# Altium project ruler.PrjPcb
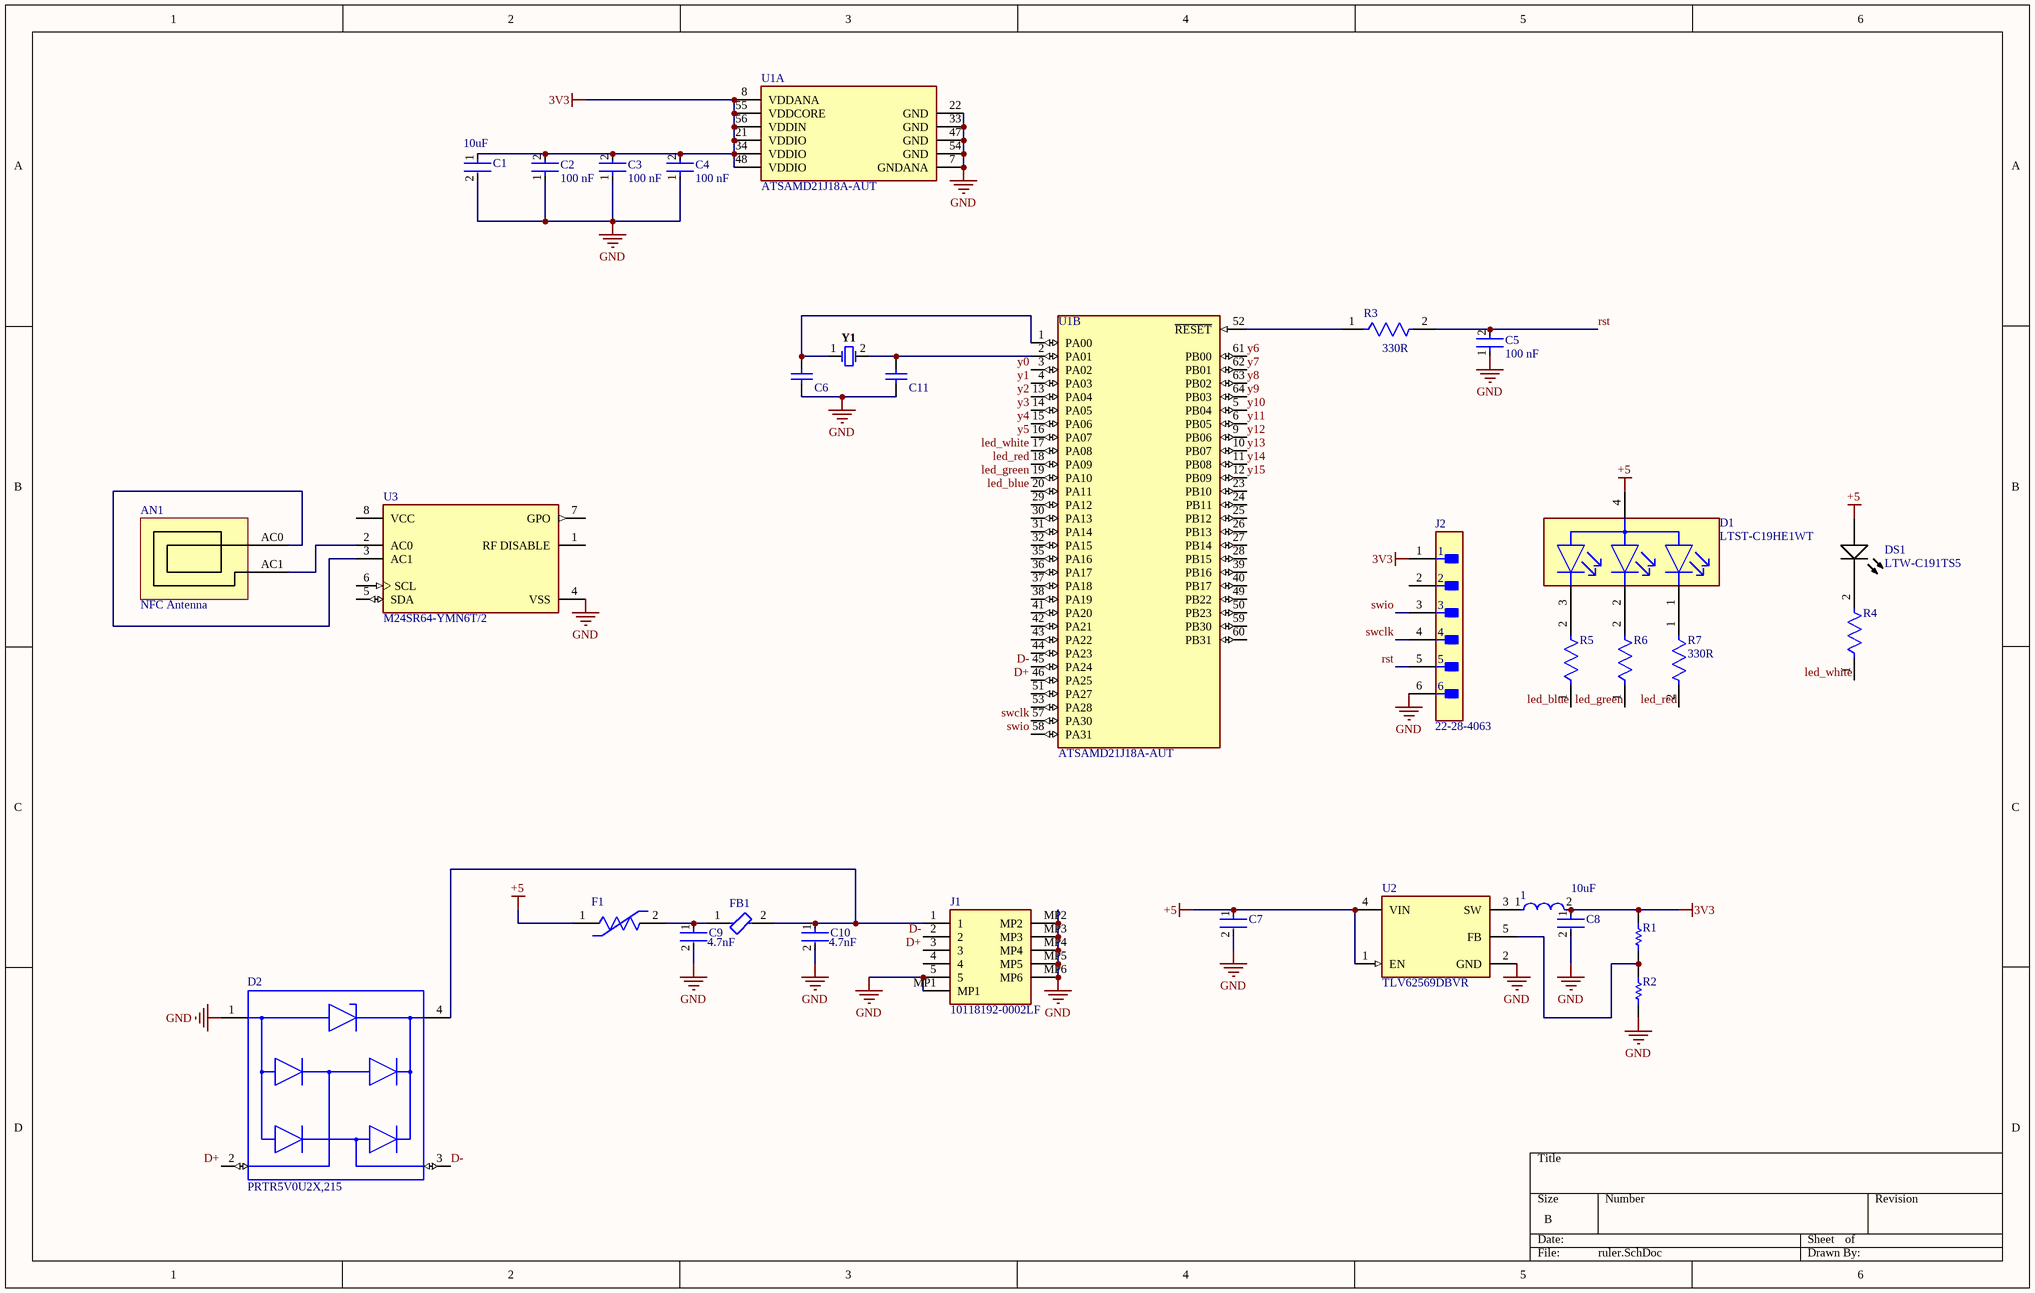
[diagram p0: ruler.SchDoc]
1 sheet, 31 parts. Net scope: global (net labels, ports and power ports of the same name join across sheets).
Board file: ruler.PcbDoc

## Sheet ruler.SchDoc
size B; SheetNumber: 1; SheetTotal: 1

### Parts
1  LQM2HPN2R2MG0L  [FP-LQM2HPN_G0-IPC_C]  (value not drawn)
AN1  NFC Antenna  [NFC_Antenna]  (no BOM)
C1  Capacitance: 10uF  [FP-CL10-IPC_B]  (hidden comment: CL10A106MP8NNNC)
C2  Capacitance: 100 nF  [FP-CC0603-DA-MFG]  (hidden comment: CC0603KRX7R9BB104)
C3  Capacitance: 100 nF  [FP-CC0603-DA-MFG]  (hidden comment: CC0603KRX7R9BB104)
C4  Capacitance: 100 nF  [FP-CC0603-DA-MFG]  (hidden comment: CC0603KRX7R9BB104)
C5  Capacitance: 100 nF  [FP-CC0603-DA-MFG]  (hidden comment: CC0603KRX7R9BB104)
C6  GRM1555C1E6R8CA01D  [CAPC1005X55X25NL05T10]  (value not drawn)
C7  CL10A475KP8NNNC  [FP-CL10-IPC_C]  (value not drawn)
C8  Capacitance: 10uF  [FP-CL10-IPC_B]  (hidden comment: CL10A106MP8NNNC)
C9  Capacitance: 4.7nF  [FP-GRM188-0_1-e0_2_0_5-MFG]  (hidden comment: GRM1885C1H472JA01D)
C10  Capacitance: 4.7nF  [FP-GRM188-0_1-e0_2_0_5-MFG]  (hidden comment: GRM1885C1H472JA01D)
C11  GRM1555C1E6R8CA01D  [CAPC1005X55X25NL05T10]  (value not drawn)
D1  LTST-C19HE1WT  [FP-LTST-C19HE1WT-MFG]
D2  PRTR5V0U2X,215  [FP-SOT143B-MFG]
DS1  LTW-C191TS5  [LTST-LTW-C191TS5_V]
F1  MF-MSMF050-2  [FP-MF-MSMF050-2-MFG]  (value not drawn)
FB1  BLM18PG471SN1D  [FP-BLM18-0_15-t0_8-MFG]  (value not drawn)
J1  10118192-0002LF  [101181920002LF]
J2  22-28-4063  [FP-22-28-4063-MFG]
R1  ERJ3EKF1913V  [RESC1608X55X30LL15T15]  (value not drawn)
R2  CRCW060342K2FKEA  [RESC1609X50X30ML10T20]  (value not drawn)
R3  Resistance: 330R  [FP-ERJPA3-MFG]  (hidden comment: ERJ-PA3J331V)
R4  ERJ-3EKF2000V  [FP-ERJ3EK-IPC_C]  (value not drawn)
R5  ERJ-3EKF2000V  [FP-ERJ3EK-IPC_C]  (value not drawn)
R6  ERJ-3EKF2000V  [FP-ERJ3EK-IPC_C]  (value not drawn)
R7  Resistance: 330R  [FP-ERJPA3-MFG]  (hidden comment: ERJ-PA3J331V)
U1  ATSAMD21J18A-AUT  [FP-MF-IPC_C]  (parts A,B of 2)
U2  TLV62569DBVR  [FP-DBV0005A-MFG]
U3  M24SR64-YMN6T/2  [FP-SO-A-MFG]
Y1  CM315D32768DZFT  [CMHT-CM315D-2_V]  (value not drawn)

### Nets
3V3: 1.2 C1.1 C2.2 C3.2 C4.2 C8.1 J2.1 R1.2 U1.8(VDDANA) U1.21(VDDIO) U1.34(VDDIO) U1.48(VDDIO) U1.55(VDDCORE) U1.56(VDDIN)
+5: C7.1 D1.4(A) DS1.1(A) F1.1 U2.1(EN) U2.4(VIN)
GND: C1.2 C2.1 C3.1 C4.1 C5.1 C6.1 C7.2 C8.2 C9.2 C10.2 C11.1 D2.1(GND) J1.5 J1.MP1 J1.MP2 J1.MP3 J1.MP4 J1.MP5 J1.MP6 J2.6 R2.1 U1.7(GNDANA) U1.22(GND) U1.33(GND) U1.47(GND) U1.54(GND) U2.2(GND) U3.4(VSS)
D+: D2.2(I/O_1) J1.3 U1.46(PA25)
D-: D2.3(I/O_2) J1.2 U1.45(PA24)
led_blue: R5.1 U1.20(PA11)
led_green: R6.1 U1.19(PA10)
led_red: R7.2 U1.18(PA09)
led_white: R4.1 U1.17(PA08)
rst: C5.2 J2.5 R3.2
swclk: J2.4 U1.57(PA30)
swio: J2.3 U1.58(PA31)
y0: U1.3(PA02)
y1: U1.4(PA03)
y2: U1.13(PA04)
y3: U1.14(PA05)
y4: U1.15(PA06)
y5: U1.16(PA07)
y6: U1.61(PB00)
y7: U1.62(PB01)
y8: U1.63(PB02)
y9: U1.64(PB03)
y10: U1.5(PB04)
y11: U1.6(PB05)
y12: U1.9(PB06)
y13: U1.10(PB07)
y14: U1.11(PB08)
y15: U1.12(PB09)
Net1_1: 1.1 U2.3(SW)
NetAN1_AC0: AN1.AC0 U3.3(AC1)
NetAN1_AC1: AN1.AC1 U3.2(AC0)
NetC6_2: C6.2 U1.1(PA00) Y1.1
NetC9_1: C9.1 F1.2 FB1.1
NetC10_1: C10.1 D2.4(VCC) FB1.2 J1.1
NetC11_2: C11.2 U1.2(PA01) Y1.2
NetD1_1: D1.1(RED_C) R7.1
NetD1_2: D1.2(GREEN_C) R6.2
NetD1_3: D1.3(BLUE_C) R5.2
NetDS1_2: DS1.2(K) R4.2
NetR1_1: R1.1 R2.2 U2.5(FB)
NetR3_1: R3.1 U1.52(~{RESET})

Not connected (* = marked no-connect by the designer): J1 4; J2 2; U1 23(PB10) 24(PB11) 25(PB12) 26(PB13) 27(PB14) 28(PB15) 29(PA12) 30(PA13) 31(PA14) 32(PA15) 35(PA16) 36(PA17) 37(PA18) 38(PA19) 39(PB16) 40(PB17) 41(PA20) 42(PA21) 43(PA22) 44(PA23) 49(PB22) 50(PB23) 51(PA27) 53(PA28) 59(PB30) 60(PB31); U3 1(RF_DISABLE) 5(SDA) 6(SCL) 7(GPO) 8(VCC)

### Library data of the parts
1 = CMP-1662-00028-2: Multilayer Type Inductor for Power Lines, 1008 (2520), 2.2μH, 20%, 0.1Ω, 1.3A; Manufacturer: Samsung; Manufacturer Part Number: CL10A106KP8NNNC; Core Material: Ferrite; DC Resistance (DCR): 100mR; Inductance: 2.2uH; Test Frequency: 1MHz; Self Resonant Frequency: 40MHz; Shielding: Shielded; Dielectric Material: Ceramic; Value: 10uF; Multilayer: Yes; Tolerance  (fill in as +-): 10%; Rated DC Voltage (URdc): 10V; Temperature Characteristics Code: X5R; Depth: 2.2mm; Length: 2.5mm; Max DC Current: 1.3A; Military Standard: Not; Current Rating: 1.3A; Termination: SMD/SMT; Radiation Hardening: No; Tolerance: 20%; Height: 1.2mm; Case Code (Metric): 2520; DC Current: 1.3A; Inductance Tolerance: 20%; Packaging: Tape and Reel; Width: 2mm; REACH SVHC: No SVHC; Mount: Surface Mount; Max Operating Temperature: 125°C; Lead Free: Lead Free; Case/Package: 1008; Case Code (Imperial): 1008; Series: LQM2HP_G0; Height - Seated (Max): 0.039inch; Package Quantity: 3000; Min Operating Temperature: -55°C; Supplier: Arrow Electronics; Supplier Part Number: CL10A106KP8NNNC; RoHS: Yes; Category: Ceramic Capacitors; Stock: 1924000; Pricing: 4000=0.0309, 8000=0.0267, 12000=0.0253, 28000=0.0232, 100000=0.0181, 200000=0.017, 400000=0.0164 (USD); Mounting Technology: Surface Mount; Pins: 2; Package Shape: Rectangular; Terminal Finish: Nickel; JESD-609 Code: e3; Capacitor Type: Ceramic; Package Style: SMTMeter; Tolerance (fill in as +-): 10%; Reach SVHC Compliant: Yes; RoHS Compliant: Yes; ComponentLink1URL: https://datasheet.ciiva.com:443/pdfs/VipMasterIC/IC/SEMS/SEMS-S-A0008384515/SEMS-S-A0008873229-1.pdf?src-supplier=IHS+Markit; ComponentLink1Description: https://datasheet.ciiva.com:443/pdfs/VipMasterIC/IC/SEMS/SEMS-S-A0008384515/SEMS-S-A0008873229-1.pdf?src-supplier=IHS+Markit; ComponentLink2URL: https://datasheet.ciiva.com/26877/getdatasheetpartid-359551-26877881.pdf?src-supplier=Verical; ComponentLink2Description: https://datasheet.ciiva.com/26877/getdatasheetpartid-359551-26877881.pdf?src-supplier=Verical; ComponentLink3URL: https://datasheet.ciiva.com/29198/457369-da-01-en-vs-kondensator-0603-29198790.pdf?src-supplier=Conrad; ComponentLink3Description: https://datasheet.ciiva.com/29198/457369-da-01-en-vs-kondensator-0603-29198790.pdf?src-supplier=Conrad; ComponentLink4URL: https://datasheet.ciiva.com/16200/cl05b104kq5nnnc-16200766.pdf?src-supplier=Future+Electronics; ComponentLink4Description: https://datasheet.ciiva.com/16200/cl05b104kq5nnnc-16200766.pdf?src-supplier=Future+Electronics; LCSC Part Number: C86092
AN1 = NFC_Antenna: L=5.51 uH, tuned for 13.56 MHz; L: 5.51 uH
C1 C8 = CMP-13271-003248-1: Cap Ceramic 10uF 10V X5R ±20% Pad SMD 0603 +85°C T/R; Length: 1.6mm; Contact Plating: Tin; Max Operating Temperature: 85°C; Lead Free: Lead Free; Case/Package: 0603; Dielectric: X5R; Packaging: Tape and Reel; Min Operating Temperature: -55°C; Mount: Surface Mount; Height: 0.8mm; Case Code (Imperial): 0603; Depth: 0.8mm; Package Quantity: 1; Width: 0.031inch; Voltage Rating (DC): 10V; Case Code (Metric): 1608; Voltage Rating: 10V; Thickness: 0.035inch; Tolerance: 20%; Radiation Hardening: No; LCSC Part Number: C85713
C2-C5 = CMP-2100-03601-2: CAP CER 0.1UF 50V X7R 0603; Manufacturer: YAGEO; Material: Ceramic; Temperature Coefficient: 15%; Tolerance: 0.1; Value: 100 nF; Height: 0.9mm; Voltage: 50 V; ComponentLink2Description: Datasheet; Device Class L2: Capacitors; Temperature Range High: +125°C; Category: Cap; Footprint Url: http://www.yageo.com/exep/pages/download/literatures/UPY-C_GEN_24.pdf; ComponentLink2URL: http://www.yageo.com/documents/recent/UPY-GPHC_X7R_6.3V-to-50V_18.pdf; Package: CC0603-DA; Temperature: -55°C to +125°C; Voltage Rating: 50 V; Temperature Characteristic: X7R; Device Class L1: Passive Components; Temperature Range Low: -55°C; Manufacturer Part Number: CC0603KRX7R9BB104; RoHS: TRUE; Automotive: No; Device Class L3: Ceramic Capacitors; Octopart: https://octopart.com/cc0603krx7r9bb104-yageo-42244635; Mouser Description: Multilayer Ceramic Capacitor, CC Series, 0.1 - F, - 10%, X7R, 50 V, 0603 [1608 Metric]; Lead Free: Yes; Digikey Description: CAP CER 0.1UF 50V X7R 0603; LCSC Part Number: C14663
C6 C11 = CMP-2008-04219-1: Manufacturer: Murata; Part Number: GRM1555C1E6R8CA01D; LCSC Part Number: C3877782
C7 = CMP-13271-003017-1: Cap Ceramic 4.7uF 10V X5R ±10% Pad SMD 0603 +85°C T/R; Capacitance: 4.7uF; Case/Package: 0603; Packaging: Tape and Reel; Width: 0.031inch; Contact Plating: Tin; Thickness: 0.035inch; Package Quantity: 1; Voltage Rating: 10V; Case Code (Metric): 1608; Case Code (Imperial): 0603; Depth: 0.8mm; Height: 0.8mm; Tolerance: 10%; Max Operating Temperature: 85°C; Length: 1.6mm; Dielectric: X5R; Mount: Surface Mount; Radiation Hardening: No; Min Operating Temperature: -55°C; LCSC Part Number: C1705
C9 C10 = CMP-2006-02564-2: Chip Multilayer Ceramic Capacitors for General Purpose, 0603, 4700pF, C0G, 30ppm/°C, 5%, 50V; Case Code (Imperial): 0603; Width: 0.8mm; Package Quantity: 4000; Termination: SMD/SMT; Lead Free: Lead Free; Voltage Rating (DC): 50V; Dielectric: C0G; Height: 0.8mm; Tolerance: 5%; Thickness: 0.035inch; Min Operating Temperature: -55°C; Voltage Rating: 50V; Mount: Surface Mount; Max Operating Temperature: 125°C; Case Code (Metric): 1608; REACH SVHC: No SVHC; Material: Ceramic; Length: 1.6mm; Packaging: Tape and Reel; Case/Package: 0603; LCSC Part Number: C85980
D1 = CMP-2000-05201-2: LED RGB DIFFUSED CHIP SMD; Number of LEDs: 3; Test Current: 20mA; Luminous Intensity: 180mcd; Lens Color: White; Dominant Wavelength: 470nm; Color: Blue; Reverse Voltage: 5V; Viewing Angle: 130°; Forward Voltage: 3.35V; Max Operating Temperature: 80°C; Packaging: Tape and Reel; Lens Transparency: Diffused; Width: 1.6mm; Case Code (Metric): 1616; Height: 0.35mm; Lens Style: Diffused; Mount: Surface Mount; Package Quantity: 3000; Radiation Hardening: No; Length: 1.6mm; Case/Package: 0606; Forward Current: 20mA; Case Code (Imperial): 0606; Lead Free: Lead Free; Min Operating Temperature: -20°C; Number of Elements: 3; Number of Pins: 4; Depth: 1.6mm; LCSC Part Number: C458749
D2 = CMP-14436-000007-1: TVS DIODE 5.5V SOT143B; LCSC Part Number: C12333
DS1 = CMP-1674-00013-1: LED Uni-Color White, 70 mW, 20 mA, -20 to 80 degC, 2-Pin SMD, RoHS, Tape and Reel; Case\Package: 0603; Power Rating: 100 mW; Voltage Rating: 50 V; Tolerance: 1%; Resistance: 12 Ohm; Min Operating Temperature: -55 degC; Mount: Surface Mount; Pins: 2; Case Code (Imperial): 0603; PackageReference: LTW-C191TS5; ComponentLink2URL: http://optoelectronics.liteon.com/upload/download/DS22-2004-201/S_110_LTW-C191TS5.pdf; REACH SVHC: No SVHC; Max Operating Temperature: 155 degC; DatasheetVersion: Rev. B, 06/2010; Packaging: Tape and Reel; RoHSCompliant: true; Height: 0.45 mm; Length: 1.6 mm; Width: 0.8 mm; Voltage Rating (DC): 50 V; ComponentLink1URL: http://www.us.liteon.com/; PackageDescription: 2-Pin Surface Mount Device, Body 1.6 x 0.8 mm; ComponentLink1Description: Manufacturer URL; Case Code (Metric): 1608; Package Quantity: 5000; ComponentLink2Description: Datasheet; LCSC Part Number: C125123
F1 = CMP-2100-03653-2: PTC RESET FUSE 15V 500MA 1812; Manufacturer: Bourns; Value: 0.15-1Ω; Trip Current: 1A; Automotive Grade: Grade 3; Trip Time: 0.15s; Current Rating: 100A; Hold Current: 0.5A; Height: 0.85mm; Package: 1812; Voltage Rating: 15V; Temperature Range High: +85°C; Device Class L2: PTC Resettable Fuses; Lead Free: Yes; ComponentLink2URL: http://www.bourns.com/docs/Product-Datasheets/mfmsmf.pdf; Ambient Temperature Range High: +85°C; Mouser Description: PTC Resettable Fuse 0.5A(hold) 1A(trip) 15V 100A 0.8W 0.15s 0.15Ohm SMD Solder Pad 1812 T/R; Digikey Description: PTC RESET FUSE 15V 500MA 1812; Manufacturer Part Number: MF-MSMF050-2; Resistance: 0.15-1Ω; Category: Fuse; ComponentLink2Description: Datasheet; Automotive: Yes; Temperature Range Low: -40°C; RoHS: TRUE; Device Class L1: Circuit Protection; Temperature: -40°C to +85°C; Octopart: https://octopart.com/mf-msmf050-2-bourns-28047; Ambient Temperature Range Low: -40°C; Device Class L3: unset; LCSC Part Number: C17313
FB1 = CMP-0686-00587-3: Chip Ferrite Bead, 0603, 470Ω @ 100MHz, 0.2Ω, 25%, 1A; DC Resistance (DCR): 200mR; Number of Circuits: 1; Material: Steel; Impedance: 470R; Core Material: Ferrite; Width: 0.8mm; Termination: SMD/SMT; Series: BLM18P; Min Operating Temperature: -55°C; DC Resistance-Max: 200mR; Current Rating: 1A; Package Quantity: 1; Max Operating Temperature: 125°C; Military Standard: Not; REACH SVHC: No SVHC; Max Current Rating: 1A; Number of Pins: 2; RoHS Compliant: Yes; Tolerance: 25%; Packaging: Tape and Reel; Number of Lines: 1; Resistance: 200mR; Length: 1.6mm; Case Code (Metric): 1608; Depth: 0.8mm; Lead Free: Lead Free; Case/Package: 0603; Height: 0.8mm; Radiation Hardening: No; Test Frequency: 100MHz; Case Code (Imperial): 0603; Max DC Current: 1A; DC Current: 1A; LCSC Part Number: C97853
J1 = 10118192-0002LF: Connector; Manufacturer_Name: Amphenol Communications Solutions; Datasheet Link: https://cdn.amphenol-cs.com/media/wysiwyg/files/drawing/10118192.pdf; Height: 3.08mm; Manufacturer_Part_Number: 10118192-0002LF; Arrow Part Number: 10118192-0002LF; Arrow Price/Stock: https://www.arrow.com/en/products/10118192-0002lf/amphenol-fci?region=nac; LCSC Part Number: C2972784
J2 = CMP-04776-000885-1: CONN HEADER VERT 6POS 2.54MM; Number of Circuits: 6; Voltage Rating (DC): 250V; Connector Type: Male Pin; Contact Resistance: 20mR; Glow Wire Compliant: Non-compliant; Gender: Male; Current Rating: 4A; Max Voltage Rating (DC): 250.25kV; Series: KK® 42375; Termination: Solder; Orientation: Straight; Max Operating Temperature: 75°C; Min Operating Temperature: 0°C; Mount: Through Hole; Depth: 2.49mm; Contact Material: Brass; Number of Positions: 6; Contact Mating Length: 0.24inch; Number of Rows: 1; Housing Color: Black; Max Voltage Rating (AC): 250V; Housing Material: Thermoplastic; Packaging: Bulk; Contact Plating: Gold; Contact Type: Male Pin; Package Quantity: 1; Number of Contacts: 6; Voltage Rating: 250V; Lead Free: Lead Free; RoHS Compliant: Yes; Pitch: 2.54mm; Color: Black; Flammability Rating: UL94 V-0; Radiation Hardening: No
R1 = CMP-2000-00311-1: Manufacturer: Panasonic; Part Number: ERJ-3EKF1913V; LCSC Part Number: C403050
R2 = CMP-2000-03344-1: Manufacturer: Vishay Dale; Part Number: CRCW060342K2FKEA; LCSC Part Number: C844563
R3 R7 = CMP-05422-000096-1: RES SMD 330 OHM 5% 1/4W 0603; Temperature Coefficient: 200ppm/°C; Max Power Dissipation: 250mW; Case Code (Imperial): 0603; Height: 0.018inch; Case/Package: 0603; Case Code (Metric): 1608; Width: 0.031inch; Length: 0.063inch; Tolerance: 5%; Features: Automotive AEC-Q200; Min Operating Temperature: -55°C; Max Operating Temperature: 155°C; Resistor Type: Thick Film; Packaging: Cut Tape; Number of Terminations: 2; LCSC Part Number: C441887
R4-R6 = CMP-2000-00316-2: RES SMD 200 OHM 1% 1/10W 0603; Power Rating: 100mW; Temperature Coefficient: 100ppm/°C; Voltage Rating (DC): 50V; Voltage Rating: 75V; Resistance: 200R; Tolerance: 1%; Lead Free: Lead Free; Packaging: Tape and Reel; Case/Package: 0603; Contact Plating: Tin; Case Code (Imperial): 0603; Min Operating Temperature: -55°C; Max Operating Temperature: 155°C; Max Power Dissipation: 100mW; Features: Automotive AEC-Q200; Technology: THICK FILM; Package Quantity: 1; Resistor Type: Thick Film; REACH SVHC: No SVHC; Termination: SMD/SMT; Length: 1.6mm; Resistance Tolerance: 1%; Series: ERJ; Military Standard: Not; Radiation Hardening: No; Working Voltage: 75V; Case Code (Metric): 1608; RoHS Compliant: Yes; Mount: Surface Mount; Construction: Rectangular; Width: 0.031inch; Number of Terminations: 2; Depth: 0.8mm; Height: 0.022inch; LCSC Part Number: C403056
U1 = CMP-06276-000070-1: IC MCU 32BIT 256KB FLASH 64TQFP; Number of I/Os: 52; Core Architecture: ARM; Frequency: 48MHz; Interface: I2C; Peripherals: Brown-out Detect/Reset; Oscillator Type: Internal; Memory Size: 256KB; Packaging: Tape and Reel; Memory Type: FLASH; Min Operating Temperature: -40°C; Max Operating Temperature: 85°C; Case/Package: TQFP; LCSC Part Number: C515529
U2 = CMP-04918-000387-1: IC REG BUCK ADJ 2A SOT23-5; Manufacturer: Samsung; Manufacturer Part Number: CL10A106KP8NNNC; Output Configuration: Positive; Min Output Voltage: 600mV; Max Output Voltage: 5.5V; Switching Frequency: 1.5MHz; Output Type: Adjustable; Synchronous Rectifier: Yes; Min Input Voltage: 2.5V; Dielectric Material: Ceramic; Value: 10uF; Tolerance  (fill in as +-): 10%; Rated DC Voltage (URdc): 10V; Temperature Characteristics Code: X5R; Output Current: 2A; Mount: Surface Mount; Min Operating Temperature: -40°C; Max Operating Temperature: 125°C; RoHS Compliant: Yes; Max Input Voltage: 5.5V; Case/Package: SOT-23-5; Packaging: Cut Tape; Supplier: Arrow Electronics; Supplier Part Number: CL10A106KP8NNNC; RoHS: Yes; Category: Ceramic Capacitors; Stock: 1924000; Pricing: 4000=0.0309, 8000=0.0267, 12000=0.0253, 28000=0.0232, 100000=0.0181, 200000=0.017, 400000=0.0164 (USD); Mounting Technology: Surface Mount; Pins: 2; Package Shape: Rectangular; Terminal Finish: Nickel; JESD-609 Code: e3; Capacitor Type: Ceramic; Multilayer: Yes; Package Style: SMTMeter; Tolerance (fill in as +-): 10%; Termination: Wraparound; Length: 1.6mm; Width: 0.8mm; Height: 0.8mm; Reach SVHC Compliant: Yes; ComponentLink1URL: https://datasheet.ciiva.com:443/pdfs/VipMasterIC/IC/SEMS/SEMS-S-A0008384515/SEMS-S-A0008873229-1.pdf?src-supplier=IHS+Markit; ComponentLink1Description: https://datasheet.ciiva.com:443/pdfs/VipMasterIC/IC/SEMS/SEMS-S-A0008384515/SEMS-S-A0008873229-1.pdf?src-supplier=IHS+Markit; ComponentLink2URL: https://datasheet.ciiva.com/26877/getdatasheetpartid-359551-26877881.pdf?src-supplier=Verical; ComponentLink2Description: https://datasheet.ciiva.com/26877/getdatasheetpartid-359551-26877881.pdf?src-supplier=Verical; ComponentLink3URL: https://datasheet.ciiva.com/29198/457369-da-01-en-vs-kondensator-0603-29198790.pdf?src-supplier=Conrad; ComponentLink3Description: https://datasheet.ciiva.com/29198/457369-da-01-en-vs-kondensator-0603-29198790.pdf?src-supplier=Conrad; ComponentLink4URL: https://datasheet.ciiva.com/16200/cl05b104kq5nnnc-16200766.pdf?src-supplier=Future+Electronics; ComponentLink4Description: https://datasheet.ciiva.com/16200/cl05b104kq5nnnc-16200766.pdf?src-supplier=Future+Electronics; LCSC Part Number: C141836
U3 = CMP-12156-000003-1: IC RFID TRANSP 13.56MHZ 8SO; Access Time: 900ns; Max Supply Voltage: 5.5V; Min Frequency: 13.553MHz; Memory Size: 64Kb; Max Frequency: 13.567MHz; Interface: I2C; Min Supply Voltage: 2.7V; RoHS Compliant: Yes; Lead Free: Lead Free; Height: 1.5mm; Operating Frequency: 13.56 MHz; Min Operating Temperature: -40°C; Frequency: 13.56MHz; Width: 4mm; Case/Package: SO; Packaging: Tape and Reel; Type: Integrated Circuit (IC); Weight: 0.01787oz; Package Quantity: 2500; Mount: Surface Mount; Reach SVHC Compliant: Yes; Max Operating Temperature: 85°C; Length: 5mm; Series: -; Access Time-Max: 900ns; Number of Pins: 8; Supplier: Mouser; Supplier Part Number: 511-M24LR04E-RMN6T/2; LCSC Part Number: C222221
Y1 = CMP-2000-05089-1: Turning Fork Crystal Unit, 32.768 KHz, -40 to 85 degC, 2-Pin SMD, RoHS, Tape and Reel; Manufacturer: Citizen Micro HumanTech; Package Version: Rev. 1.4, 09/2012; Package Reference: CM315D-2; Package Description: 2-Pin Surface Mount Device, Body 1.6 x 3.3 mm, Pitch 2.5 mm; Package URL: http://cfm.citizen.co.jp/english/product/pdf/CM315D.pdf; Manufacturer URL: http://www.citizen-systems.com/us/start; Datasheet Version: Rev. 1.4, 09/2012; Datasheet URL: http://cfm.citizen.co.jp/english/product/pdf/CM315D.pdf; LCSC Part Number: C182057

## Assembly variants
assembly: not fitted AN1 J2